# Altium schematic sheet TermWylPomp1_supp.SchDoc
size A4; Subtitle0: Zasilacze; Subtitle1: i; Subtitle2: przekaźniki; LotOfPieces: 1
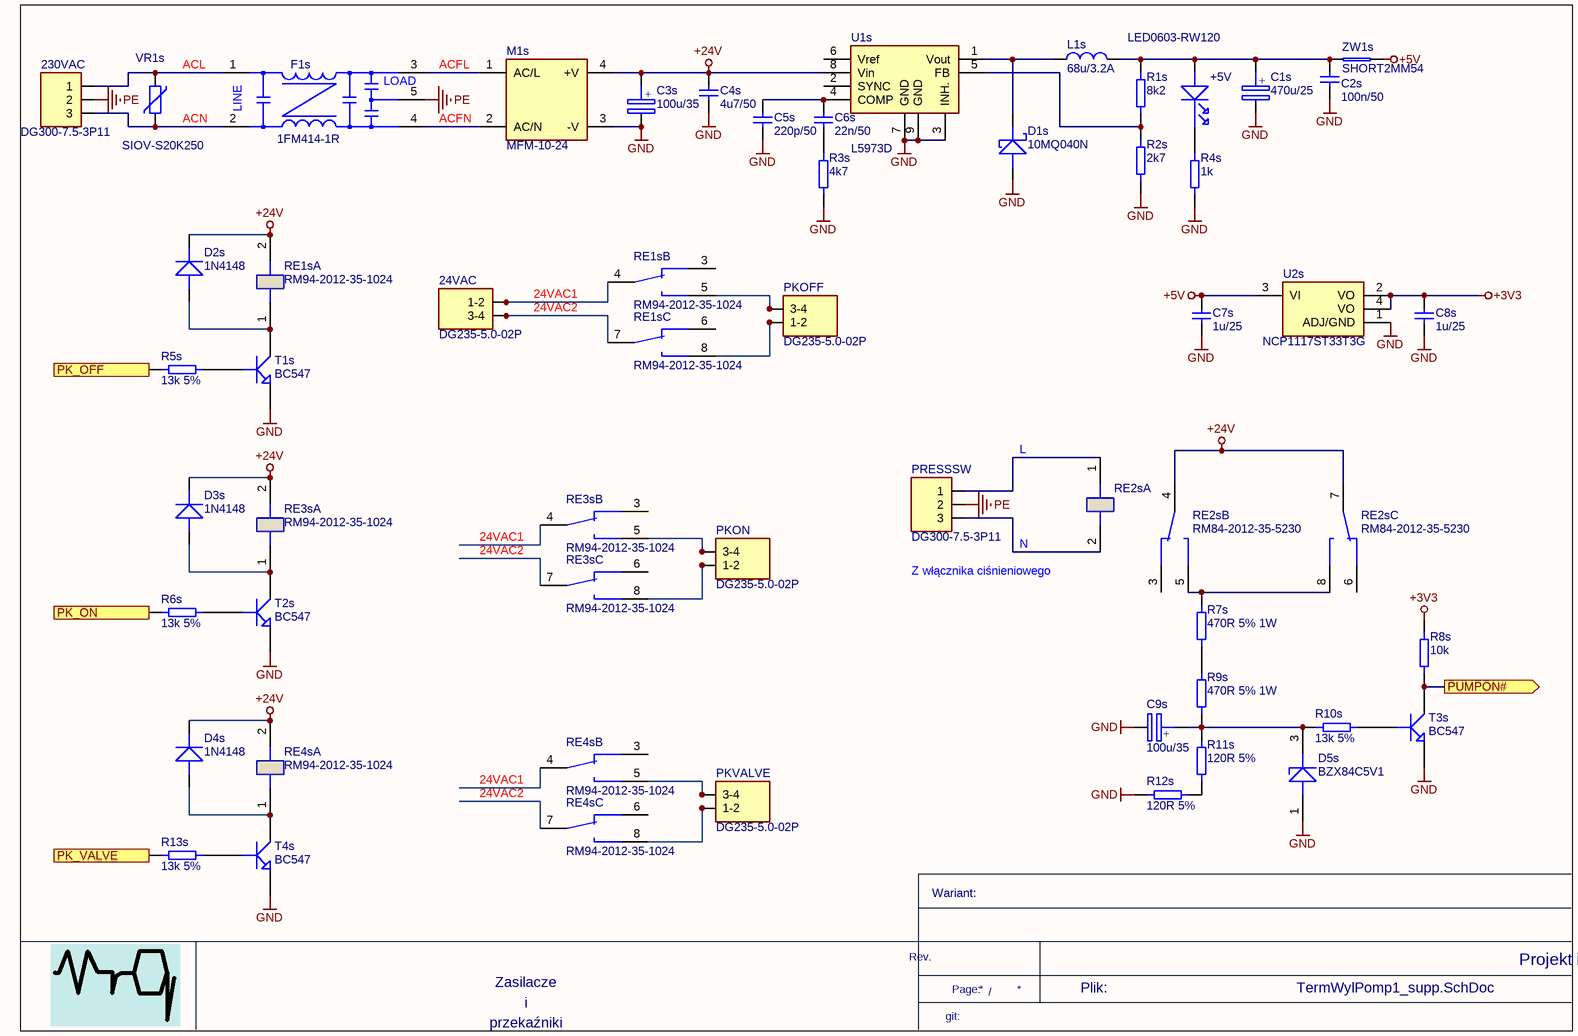
[diagram p0: TermWylPomp1_supp.SchDoc]

## Parts
24VAC  DG235-5.0-02P  [DG235-5.0-02P]
230VAC  DG300-7.5-3P11  [DG300-7.5-3P11]
+5V  LED0603-RW120  [D0603]
C1s  470u/25  [CE2040]
C2s  100n/50  [0805]
C3s  100u/35  [CE1028]
C4s  4u7/50  [1210]
C5s  220p/50  [0603-IPC]
C6s  22n/50  [0603-IPC]
C7s  1u/25  [0805]
C8s  1u/25  [0805]
C9s  100u/35  [CE1028]
D1s  10MQ040N  [SMA]
D2s  1N4148  [CE02]
D3s  1N4148  [CE02]
D4s  1N4148  [CE02]
D5s  BZX84C5V1  [SOT23-3]
F1s  1FM414-1R  [1FM414]
L1s  68u/3.2A  [SRR1208]
M1s  MFM-10-24  [MFM-10-24]
PKOFF  DG235-5.0-02P  [DG235-5.0-02P]
PKON  DG235-5.0-02P  [DG235-5.0-02P]
PKVALVE  DG235-5.0-02P  [DG235-5.0-02P]
PRESSSW  DG300-7.5-3P11  [DG300-7.5-3P11]
R1s  8k2  [0805R]
R2s  2k7  [0805R]
R3s  4k7  [0603R]
R4s  1k  [0805R]
R5s  13k 5%  [R402510]
R6s  13k 5%  [R402510]
R7s  470R 5% 1W  [R705226]
R8s  10k  [R402510]
R9s  470R 5% 1W  [R705226]
R10s  13k 5%  [R402510]
R11s  120R 5%  [R402510]
R12s  120R 5%  [R402510]
R13s  13k 5%  [R402510]
RE1s  RM94-2012-35-1024  [RM84-P]  (parts A,B,C of 3)
RE2s  RM84-2012-35-5230  [RM84-P]  (value not drawn)  (parts A,B,C of 3)
RE3s  RM94-2012-35-1024  [RM84-P]  (parts A,B,C of 3)
RE4s  RM94-2012-35-1024  [RM84-P]  (parts A,B,C of 3)
T1s  BC547  [CE35V4]
T2s  BC547  [CE35V4]
T3s  BC547  [CE35V4]
T4s  BC547  [CE35V4]
U1s  L5973D  [HSOP8]
U2s  NCP1117ST33T3G  [SOT-223]
VR1s  SIOV-S20K250  [SIOV-S20K275]
ZW1s  SHORT2MM54  [SHUNT_2MM54]

## Ports
PK_OFF (in), PK_ON (in), PK_VALVE (in), PUMPON# (out)

## Nets
+3V3: C8s.1 R8s.1 U2s.2(VO) U2s.4(VO)
+5V: C7s.1 U2s.3(VI) ZW1s.2
+24V: C3s.2 C4s.1 D2s.CATH D3s.CATH D4s.CATH M1s.4(+V) RE1s.2(A2) RE2s.4 RE2s.7 RE3s.2(A2) RE4s.2(A2) U1s.8(Vin)
GND: C1s.1 C2s.2 C3s.1 C4s.2 C5s.2 C7s.2 C8s.2 C9s.1 D1s.2(ANOD) D5s.1 M1s.3(-V) R2s.2 R3s.2 R4s.2 R12s.2 T1s.EMIT T2s.EMIT T3s.EMIT T4s.EMIT U1s.3(INH.) U1s.7(GND) U1s.9(GND) U2s.1(ADJ/GND)
PE: 230VAC.2 F1s.5 PRESSSW.2
24VAC1: 24VAC.1(1-2) 24VAC.2 RE1s.4 RE3s.4 RE4s.4
24VAC2: 24VAC.3(3-4) 24VAC.4 RE1s.7 RE3s.7 RE4s.7
ACFL: F1s.3(OUT2) M1s.1(AC/L)
ACFN: F1s.4(OUT1) M1s.2(AC/N)
ACL: 230VAC.1 F1s.1(IN1) VR1s.1
ACN: 230VAC.3 F1s.2(IN2) VR1s.2
PK_OFF: R5s.1 ; port PK_OFF
PK_ON: R6s.1 ; port PK_ON
PK_VALVE: R13s.1 ; port PK_VALVE
PUMPON#: R8s.2 T3s.COLL ; port PUMPON#
Net+5V_ANOD: +5V.ANOD C1s.2 C2s.1 L1s.2 R1s.1 ZW1s.1
Net+5V_CATH: +5V.CATH R4s.1
NetC5s_1: C5s.1 C6s.1 U1s.4(COMP)
NetC6s_2: C6s.2 R3s.1
NetC9s_2: C9s.2 D5s.3 R9s.2 R10s.1 R11s.1
NetD1s_1: D1s.1(CATH) L1s.1 U1s.1(Vout)
NetD2s_ANOD: D2s.ANOD RE1s.1(A1) T1s.COLL
NetD3s_ANOD: D3s.ANOD RE3s.1(A1) T2s.COLL
NetD4s_ANOD: D4s.ANOD RE4s.1(A1) T4s.COLL
NetPKOFF_1: PKOFF.1(1-2) PKOFF.2 RE1s.8
NetPKOFF_3: PKOFF.3(3-4) PKOFF.4 RE1s.5
NetPKON_1: PKON.1(1-2) PKON.2 RE3s.8
NetPKON_3: PKON.3(3-4) PKON.4 RE3s.5
NetPKVALVE_1: PKVALVE.1(1-2) PKVALVE.2 RE4s.8
NetPKVALVE_3: PKVALVE.3(3-4) PKVALVE.4 RE4s.5
NetPRESSSW_1: PRESSSW.1 RE2s.1(A1)
NetPRESSSW_3: PRESSSW.3 RE2s.2(A2)
NetR1s_2: R1s.2 R2s.1 U1s.5(FB)
NetR5s_2: R5s.2 T1s.BASE
NetR6s_2: R6s.2 T2s.BASE
NetR7s_1: R7s.1 RE2s.5 RE2s.8
NetR7s_2: R7s.2 R9s.1
NetR10s_2: R10s.2 T3s.BASE
NetR11s_2: R11s.2 R12s.1
NetR13s_2: R13s.2 T4s.BASE

Not connected (* = marked no-connect by the designer): RE1s 3(22) 6(12); RE2s 3(22) 6(12); RE3s 3(22) 6(12); RE4s 3(22) 6(12); U1s 2(SYNC) 6(Vref)

## Notes on the sheet
- L
- Z włącznika ciśnieniowego
- N
- Wariant:
- Rev.
- /
- Projekt i wykonanie: (C) Miroslaw Lach MRQ, www.mlach.com
- git:
- Page:
- Plik:
- (in symbol CAP15) +
- (in symbol CAP81) +
- (in symbol Ind14) LOAD; LINE

## Library data of the parts
24VAC = Con29: Kod: Con29; ID: 29; Descript: Listwa zaciskowa; kątowe 90°; 1,5mm2; tory:2; cynowany; 15A; szary; Typ5: DG235-5.0-02P-11-00A(H); Replacement: bd; Value: DG235-5.0-02P; Price5: 0; DateOfPrice5: 2010-01-01; Supplier5: tme.pl; Reference5: DG235-5.0-02P; Manufacturer5: Degson
230VAC PRESSSW = Con33: Descript: Listwa zaciskowa; kątowe 90°; 2,5mm2; 7,5mm; tory:3; cynowany; 24A; Typ5: DG300-7.5-03P-11-00A(H); Replacement: maritex: TB7503S; Kod: Con33; ID: 33; Value: DG300-7.5-3P11; Reference5: DG300-7.5-3P11; Supplier5: tme.pl; Manufacturer5: Degson; Price5: 1; DateOfPrice5: 2010-01-01
+5V = Opt25: Descript: Dioda LED, SMD 0603, Czerwona 626-636nm, 50-70 mCd /10mA, water clear, 120°; Kod: Opt25; ID: 25; Value: LED0603-RW120; Supplier5: maritex.com.pl; Reference5: LED0603-RW120; Typ5: LED0603-RW120; Price5: 0,12; DateOfPrice5: 2020-05-10; Manufacturer5: Honglitronic
C1s = CAP81: Descript: capacitor electrolythic 470uF/25V, 20%, 10x16, 5mm, low ESR; Reference5: GT470/25; Typ5: GT470u/25; Kod: CAP81; ID: 81; Value: 470u/25; Supplier5: tme.pl; Manufacturer5: Samxon; Price5: 0; DateOfPrice5: 2010-01-01
C2s = CAP7: Descript: Kondensator: ceramiczny; MLCC; 100nF; 50V; X7R; ±10%; SMD; 0805; Reference5: CL21B104KBCNNNC; Kod: CAP7; ID: 7; Value: 100n/50; Supplier5: tme.pl; Manufacturer5: Samsung; Typ5: CL21B104KBCNNNC; Price5: 0; DateOfPrice5: 2010-01-01
C3s C9s = CAP15: Descript: Kondensator: elektrolityczny; THT; 100uF; 35VDC; Ø6,3x11mm; ±20%; Reference5: SD1V107M6L011BB; Kod: CAP15; ID: 15; Value: 100u/35; Supplier5: tme.pl; Manufacturer5: SAMHA; Typ5: SD1V107M6L011BB; Price5: 0; DateOfPrice5: 2010-01-01
C4s = CAP99: Descript: Kondensator: ceramiczny; 4,7uF; 50V; X7R; ±10%; SMD; 1210; -55÷125°C; Reference5: CL32B475KBUYNNE; Kod: CAP99; ID: 99; Value: 4u7/50; Supplier5: tme.pl; Manufacturer5: Samsung; Typ5: CL32B475KBUYNNE; Price5: 2; DateOfPrice5: 2010-01-01
C5s = CAP45: Descript: Kondensator: ceramiczny; 220pF; 50V; X7R; ±10%; SMD; 0603; -55÷125°C; Reference5: CL10B221KB8NNNC; Kod: CAP45; ID: 45; Value: 220p/50; Supplier5: tme.pl; Manufacturer5: Samsung; Typ5: CL10B221KB8NNNC; Price5: 0; DateOfPrice5: 2010-01-01
C6s = CAP51: Descript: Kondensator: ceramiczny; 22nF; 50V; X7R; ±10%; SMD; 0603; -55÷125°C; Reference5: CL10B223KB8NNNC; Kod: CAP51; ID: 51; Value: 22n/50; Supplier5: tme.pl; Manufacturer5: Samsung; Typ5: CL10B223KB8NNNC; Price5: 0; DateOfPrice5: 2010-01-01
C7s C8s = CAP38: Descript: Kondensator: ceramiczny; MLCC; 1uF; 25V; X7R; ±10%; SMD; 0805; Reference5: CL21B105KAFNNN; Kod: CAP38; ID: 38; Value: 1u/25; Supplier5: tme.pl; Manufacturer5: Samsung; Typ5: CL21B105KAFNNN; Price5: 0; DateOfPrice5: 2010-01-01
D1s = DIO1: Descript: Dioda: prostownicza Schottky; SMD; 40V; 2,1A; DO214AC; Reference5: 10MQ040NTRPBF; Typ5: VS-10MQ040NTRPBF; Kod: DIO1; ID: 1; Value: 10MQ040N; Supplier5: tme.pl; Manufacturer5: Vishay; Price5: 0; DateOfPrice5: 2010-01-01
D2s D3s D4s = DIO2: Kod: DIO2; ID: 2; Descript: Dioda: przełączająca; 100V; 300mA; 2A; DO35; Reference5: 1N4148-TAP; Value: 1N4148; Price5: 0; DateOfPrice5: 2010-01-01; Supplier5: tme.pl; Manufacturer5: Vishay; Typ5: 1N4148-TAP
D5s = DIO13: Descript: Zener diode 5.1V, 0.3W, SOT-23; Typ5: BZX84-C5V1.215; Kod: DIO13; ID: 13; Value: BZX84C5V1; Reference5: BZX84C5V1; Supplier5: tme.pl; Manufacturer5: NXP; Price5: 0; DateOfPrice5: 2010-01-01
F1s = Ind14: Descript: Radio filter 250VAC, 1A; Kod: Ind14; ID: 14; Value: 1FM414-1R; Reference5: 1FM414-1R; Supplier5: tme.pl; Manufacturer5: FilterCon; Price5: 15; DateOfPrice5: 2010-01-01; InductCurr: -; Typ5: -
L1s = Ind37: Descript: 7447709680 - Cewka mocy do montażu powierzchniowego, Seria WE-PD, 68 µH, 3.2 A, 3.6 A, Osłonięte, 0.089 ohm; Reference5: 1635947; Typ5: 7447709680; Kod: Ind37; ID: 37; InductCurr: 3,2A; Value: 68u/3.2A; DateOfPrice5: 2010-01-01; Manufacturer5: Wuerth; Price5: 10; Supplier5: farnell.com
M1s = Mod92: Kod: Mod92; ID: 92; Descript: Zasilacz: impulsowy; 10W; 80÷264VAC; Wyjścia: 1; 420mA; -30÷85°C; Value: MFM-10-24; Price5: 33; DateOfPrice5: 2010-01-01; Supplier5: tme.pl; Reference5: MFM-10-24; Manufacturer5: MeanWell; Typ5: MFM-10-24
PKOFF PKON PKVALVE = Con29: Descript: Listwa zaciskowa; kątowe 90°; 1,5mm2; tory:2; cynowany; 15A; szary; Typ5: DG235-5.0-02P-11-00A(H); Replacement: bd; Kod: Con29; ID: 29; Value: DG235-5.0-02P; Reference5: DG235-5.0-02P; Supplier5: tme.pl; Manufacturer5: Degson; Price5: 0; DateOfPrice5: 2010-01-01
R1s = Res233: Descript: Rezystor: thick film; SMD; 0805; 8,2kΩ; 0,125W; ±1%; -55÷125°C; Reference5: SMD0805-8K2-1%; Typ5: 0805S8F8201T5E; Kod: Res233; ID: 233; Value: 8k2; Supplier5: tme.pl; Manufacturer5: Royal Ohm; Price5: 0,1; DateOfPrice5: 2020-06-25 12:16:54
R2s = Res115: Descript: Rezystor: thick film; SMD; 0805; 2,7kΩ; 0,125W; ±1%; -55÷125°C; Reference5: SMD0805-2K7-1%; Typ5: 0805S8F2701T5E; Kod: Res115; ID: 115; Value: 2k7; Supplier5: tme.pl; Manufacturer5: Royal Ohm; Price5: 0,1; DateOfPrice5: 2020-06-25 12:16:54
R3s = Res171: Descript: Rezystor: thick film; SMD; 0603; 4,7kom; 0,1W; ±1%; -55÷125°C; Reference5: SMD0603-4K7-1%; Typ5: 0603SAF4701T5E; Kod: Res171; ID: 171; Value: 4k7; Supplier5: tme.pl; Manufacturer5: Royal Ohm; Price5: 0,1; DateOfPrice5: 2020-06-25 12:16:54
R4s = Res53: Descript: Rezystor: thick film; SMD; 0805; 1kom; 0,125W; ±1%; -55÷125°C; Reference5: SMD0805-1K-1%; Typ5: 0805WAF 1K T5E; Kod: Res53; ID: 53; Value: 1k; Supplier5: tme.pl; Manufacturer5: Royal Ohm; Price5: 0,1; DateOfPrice5: 2020-06-25 12:16:54
R5s R6s R10s R13s = Res66: Descript: Rezystor: węglowy; THT; 13kΩ; 0,25W; ±5%; Ø2,5x6,8mm; osiowe; Reference5: ML0.25W-13K-5%; Typ5: CFR0W4J0133A50; Kod: Res66; ID: 66; Value: 13k 5%; Supplier5: mrq; Manufacturer5: Royal Ohm; Price5: 0,06; DateOfPrice5: 2020-07-26 12:26:58
R7s R9s = Res63: Descript: ML1W-470R-5% Rezystor metalizowany THT 470om; 1W; ±5%; O5,5x13mm; Reference5: ML1W-470R-5%; Kod: Res63; ID: 63; Value: 470R 5% 1W; Supplier5: mrq; Manufacturer5: -; Price5: 0,1; Typ5: -; DateOfPrice5: 2020-08-01 09:57:11
R8s = Res17: Descript: Rezystor: metal film; THT; 10kΩ; 0,6W; ±1%; Ø2,5x6,8mm; 50ppm/°C; Reference5: M0.6W-10K; Typ5: MF006FF1002A50; Kod: Res17; ID: 17; Value: 10k; Supplier5: tme.pl; Manufacturer5: Royal Ohm; Price5: 0,1; DateOfPrice5: 2020-06-25 12:16:54
R11s R12s = Res32: Descript: Rezystor: węglowy; THT; 120Ω; 0,25W; ±5%; Ø2,5x6,8mm; osiowe; Reference5: 1/4W120R; Typ5: CFR0W4J0121A50; Kod: Res32; ID: 32; Value: 120R 5%; Supplier5: tme; Manufacturer5: Royal Ohm; Price5: 0,1; DateOfPrice5: 2020-08-01 06:36:55
RE1s RE3s RE4s = Rel24: Descript: Przekaźnik: elektromagnetyczny; DPDT; Ucewki : 24VDC; 8A/250VAC, nie produkowany; Kod: Rel24; ID: 24; Value: RM94-2012-35-1024; Supplier5: -; Reference5: RM94-2012-35-1024; Manufacturer5: Relpol; Typ5: RM94-2012-35-1024; Price5: 5; DateOfPrice5: 2020-07-19 19:16:04
RE2s = Rel15: Descript: Przekaźnik: elektromagnetyczny; DPDT; Ucewki: 230VAC; 8A/250VAC; Reference5: RM84-P-230VAC; Kod: Rel15; ID: 15; Value: RM84-2012-35-5230; Supplier5: tme.pl; Manufacturer5: Relpol; Typ5: RM84-2012-35-5230; Price5: 15; DateOfPrice5: 2010-01-01
T1s T2s T3s T4s = Tra9: Descript: Tranzystor: NPN; bipolarny; 50V; 100mA; 500mW; TO92; Reference5: BC547A; Kod: Tra9; ID: 9; Value: BC547; Supplier5: tme.pl; Manufacturer5: Diotec; Price5: 0,1; Typ5: BC547A; DateOfPrice5: 2010-01-01
U1s = ICs119: Descript: Driver; przetwornica DC/DC; 2,5A; 1,2÷35V; 2,25W; Kanały: 1; 250kHz; Kod: ICs119; ID: 119; Value: L5973D; Supplier5: tme.pl; Reference5: L5973D; Manufacturer5: ST; Typ5: L5973D; Price5: 10; DateOfPrice5: 2010-01-01
U2s = ICs176: Descript: Stabilizator napięcia; LDO, liniowy, nieregulowany; 3,3V; 1A; SMD; Kod: ICs176; ID: 176; Value: NCP1117ST33T3G; Supplier5: tme; Reference5: NCP1117ST33T3G; Manufacturer5: ON Semiconductor; Typ5: NCP1117ST33T3G; Price5: 0; DateOfPrice5: 2010-01-01
VR1s = Vre35: Descript: Warystor: metalowo-tlenkowy; THT; 250VAC; 320VDC; 390V; 8000A; 140J; Kod: Vre35; ID: 35; Value: SIOV-S20K250; Reference5: SIOV-S20K250; Supplier5: tme.pl; Manufacturer5: Epcos; Price5: 2,6; Typ5: S20K250; DateOfPrice5: 2020-06-03
ZW1s = Res74: Kod: Res74; ID: 74; Descript: Przewlekana zwora z drutu o rozstawie 2.54mm; Value: SHORT2MM54; Price5: 0,1; Manufacturer5: -; Reference5: -; Supplier5: -; Typ5: -; DateOfPrice5: 2020-08-11 22:24:50